# Altium schematic sheet Kill.SchDoc
size A
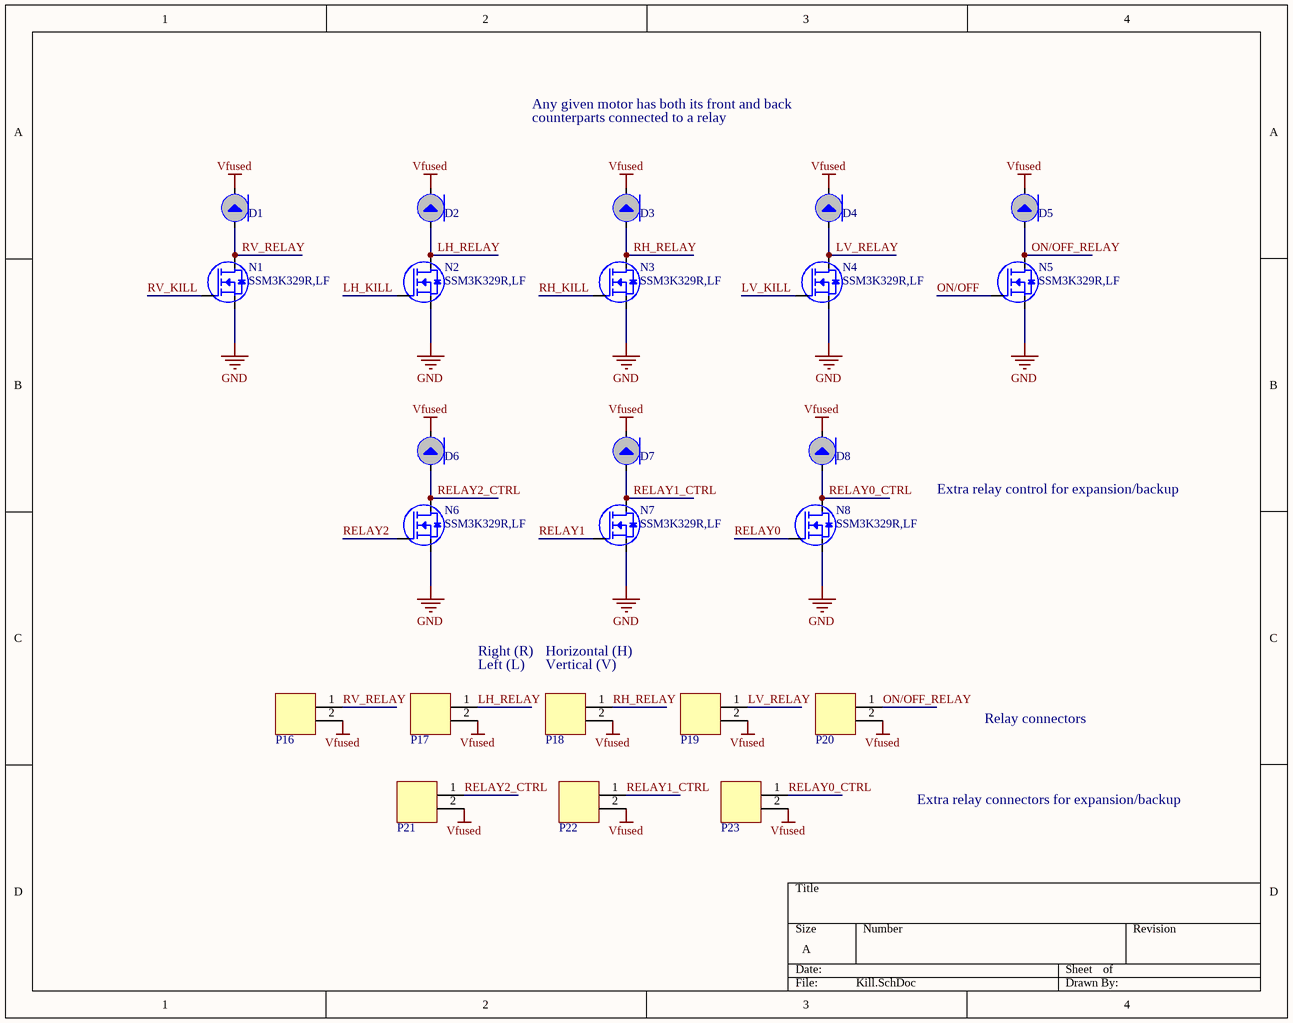
[diagram p0: Kill.SchDoc]

## Parts
D1  Diode  [TEMD5510FX01]  (value not drawn)
D2  Diode  [TEMD5510FX01]  (value not drawn)
D3  Diode  [TEMD5510FX01]  (value not drawn)
D4  Diode  [TEMD5510FX01]  (value not drawn)
D5  Diode  [TEMD5510FX01]  (value not drawn)
D6  Diode  [TEMD5510FX01]  (value not drawn)
D7  Diode  [TEMD5510FX01]  (value not drawn)
D8  Diode  [TEMD5510FX01]  (value not drawn)
N1  SSM3K329R,LF  [SSM3K329R,LF]
N2  SSM3K329R,LF  [SSM3K329R,LF]
N3  SSM3K329R,LF  [SSM3K329R,LF]
N4  SSM3K329R,LF  [SSM3K329R,LF]
N5  SSM3K329R,LF  [SSM3K329R,LF]
N6  SSM3K329R,LF  [SSM3K329R,LF]
N7  SSM3K329R,LF  [SSM3K329R,LF]
N8  SSM3K329R,LF  [SSM3K329R,LF]
P16  2-pin Vert Sherlock  [MOLEX-HDR-1X2-SHERLOCK-VERT]  (value not drawn)
P17  2-pin Vert Sherlock  [MOLEX-HDR-1X2-SHERLOCK-VERT]  (value not drawn)
P18  2-pin Vert Sherlock  [MOLEX-HDR-1X2-SHERLOCK-VERT]  (value not drawn)
P19  2-pin Vert Sherlock  [MOLEX-HDR-1X2-SHERLOCK-VERT]  (value not drawn)
P20  2-pin Vert Sherlock  [MOLEX-HDR-1X2-SHERLOCK-VERT]  (value not drawn)
P21  2-pin Vert Sherlock  [MOLEX-HDR-1X2-SHERLOCK-VERT]  (value not drawn)
P22  2-pin Vert Sherlock  [MOLEX-HDR-1X2-SHERLOCK-VERT]  (value not drawn)
P23  2-pin Vert Sherlock  [MOLEX-HDR-1X2-SHERLOCK-VERT]  (value not drawn)

## Nets
GND: N1.2(S) N2.2(S) N3.2(S) N4.2(S) N5.2(S) N6.2(S) N7.2(S) N8.2(S)
Vfused: D1.C D2.C D3.C D4.C D5.C D6.C D7.C D8.C P16.2 P17.2 P18.2 P19.2 P20.2 P21.2 P22.2 P23.2
LH_KILL: N2.1(G)
LH_RELAY: D2.A N2.3(D) P17.1
LV_KILL: N4.1(G)
LV_RELAY: D4.A N4.3(D) P19.1
ON/OFF: N5.1(G)
ON/OFF_RELAY: D5.A N5.3(D) P20.1
RELAY0: N8.1(G)
RELAY0_CTRL: D8.A N8.3(D) P23.1
RELAY1: N7.1(G)
RELAY1_CTRL: D7.A N7.3(D) P22.1
RELAY2: N6.1(G)
RELAY2_CTRL: D6.A N6.3(D) P21.1
RH_KILL: N3.1(G)
RH_RELAY: D3.A N3.3(D) P18.1
RV_KILL: N1.1(G)
RV_RELAY: D1.A N1.3(D) P16.1

## Notes on the sheet
- Any given motor has both its front and back
- counterparts connected to a relay
- Extra relay control for expansion/backup
- Right (R)
- Left (L)
- (near P18) Horizontal (H)
- (near P18) Vertical (V)
- Relay connectors
- Extra relay connectors for expansion/backup

## Library data of the parts
D1-D8 = Diode: Standard Diode Template
N1-N8 = SSM3K329R,LF: MOSFET N CH 30V 3.5A 2-3Z1A; Manufacturer 1: Toshiba Semiconductor and Storage; Supplier 1: Digi-Key; Supplier Part Number 1: SSM3K329RLFTR-ND; Manufacturer Part Number 1: SSM3K329R,LF
P16-P23 = MOLEX-HDR-1x2-SHERLOCK_VERT: Header, Molex, 2mm Pitch Sherlock Header, Single Row, Vertical, 2 Circuits, Length 3.3mm, 0353620250; Manufacturer Part Number: *; Order Part Number: *